# EAGLE schematic gate_controller_A3 (EAGLE 7.2.0)
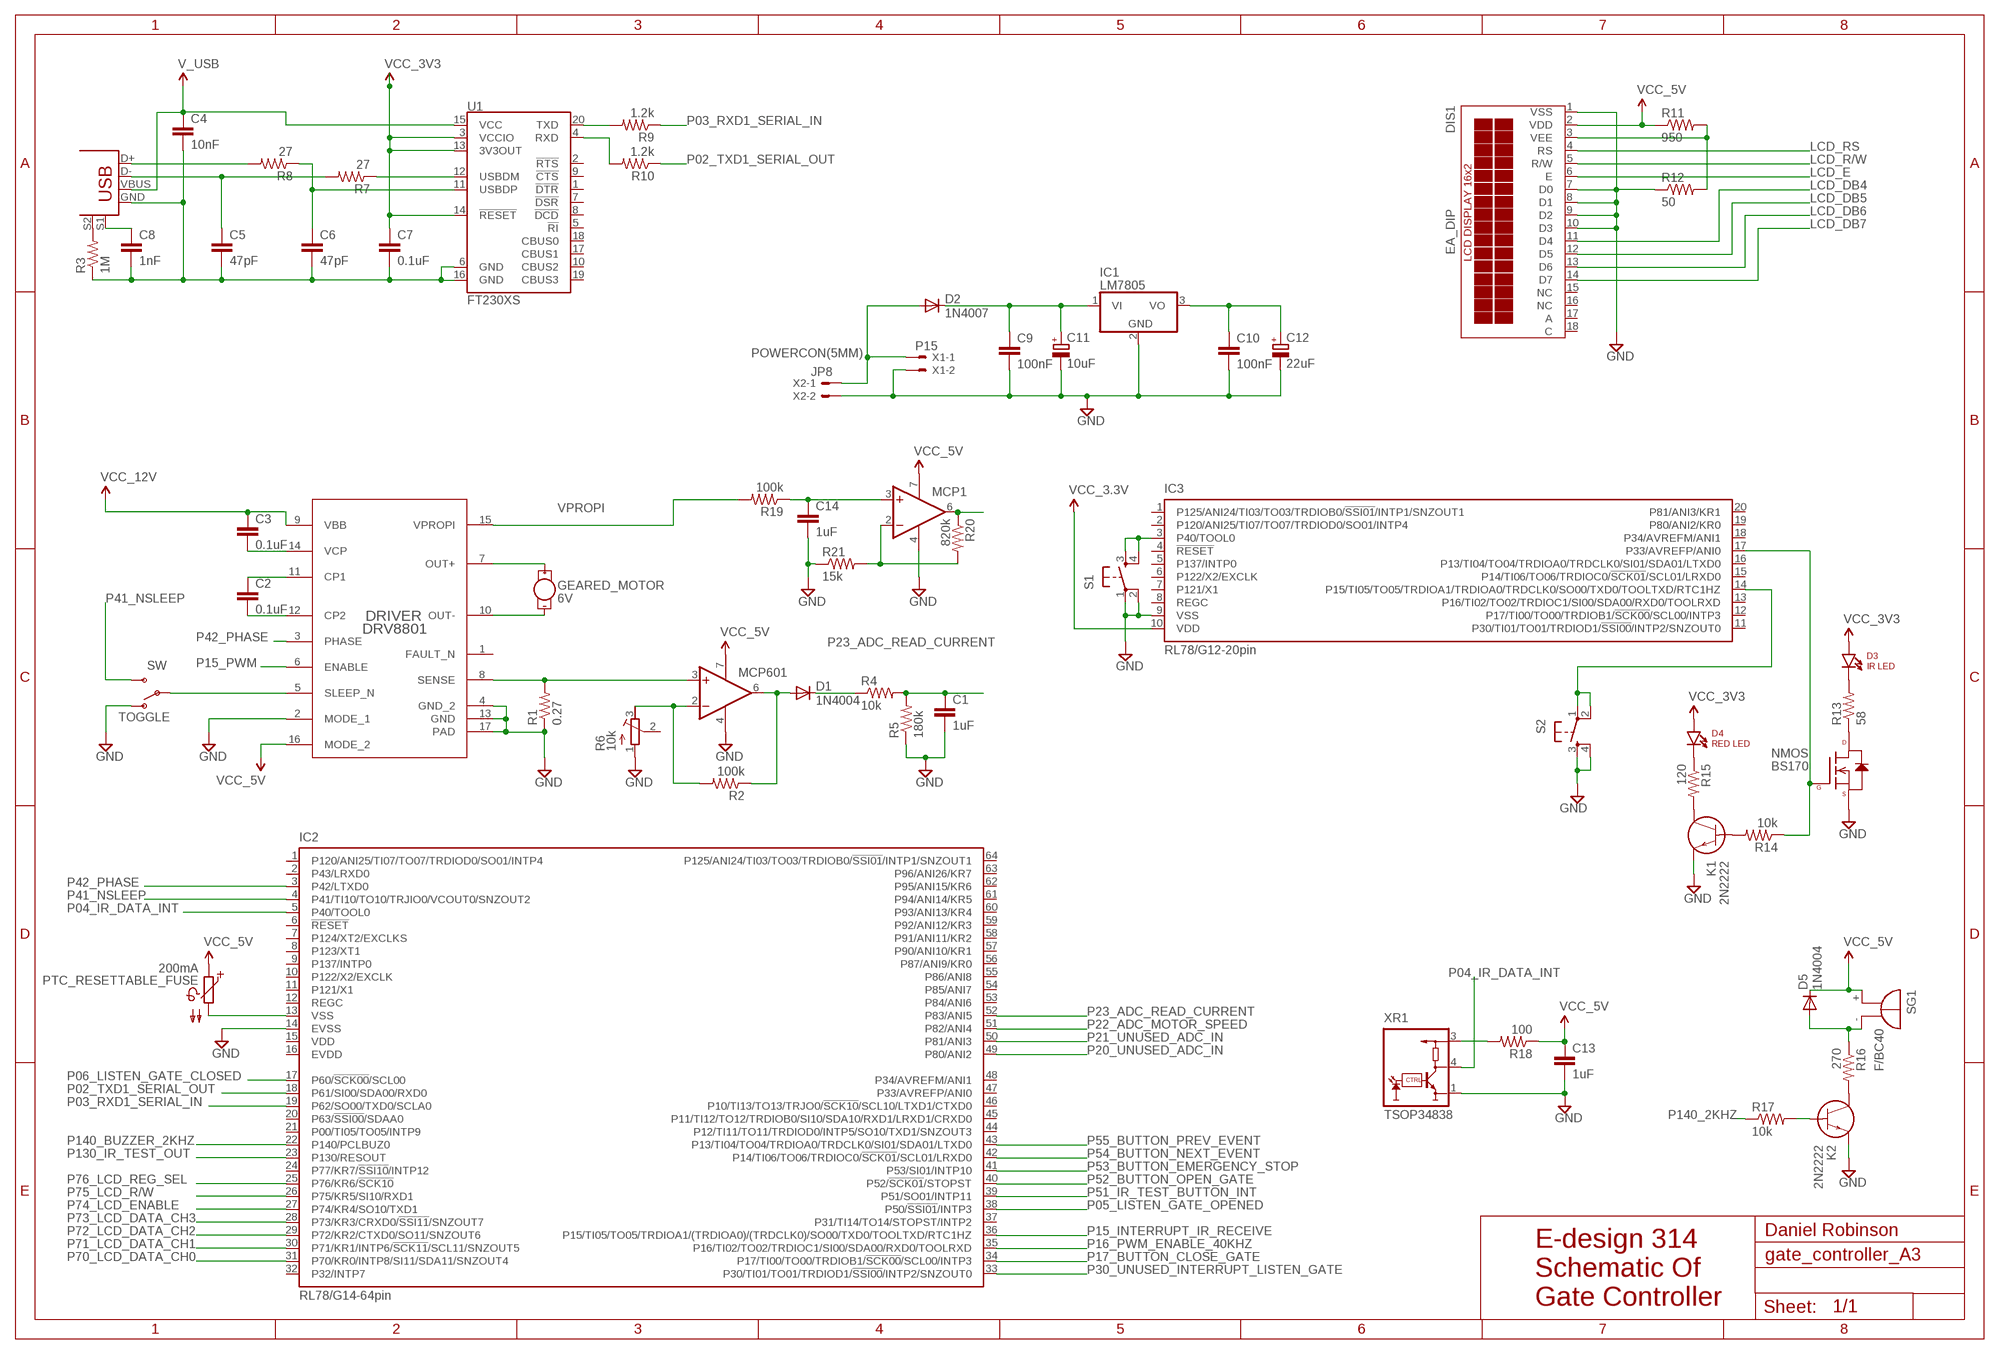
[diagram p0: schematic, sheet 1]

## Parts
C1  1uF  C2,5-3  [C2.5-3]
C2  0.1uF  C2,5-3  [C2.5-3]
C3  0.1uF  C2,5-3  [C2.5-3]
C4  10nF  C2,5-3  [C2.5-3]
C5  47pF  C2,5-3  [C2.5-3]
C6  47pF  C2,5-3  [C2.5-3]
C7  0.1uF  C2,5-3  [C2.5-3]
C8  1nF  C2,5-3  [C2.5-3]
C9  100nF  C2,5-3  [C2.5-3]
C10  100nF  C2,5-3  [C2.5-3]
C11  10uF  CPOL-EU085CS-1AR  [085CS_1AR]
C12  22uF  CPOL-EU085CS-1AR  [085CS_1AR]
C13  1uF  C2,5-3  [C2.5-3]
C14  1uF  C2,5-3  [C2.5-3]
D1  1N4004  [DO41-10]
D2  1N4007  1N4004  [DO41-10]
D3  IR LED  LTE-302  [LTE-302]
D4  RED LED  LTE-302  [LTE-302]
D5  1N4004  [DO41-10]
DIS1  EA_DIP  [EA_DIP]
DRIVER  DRV8801  DRV8801PWPR  [PWP0016B_N]
GEARED_MOTOR  6V  MOTOR10MM  [VIBE-MOTOR-10MM]
IC1  LM7805  LM2937  [TO263-3]
IC2  RL78/G14-64pin  RL78/F13-64  [P-LFQFP64-10X10]
IC3  RL78/G12-20pin  RL78/F13-20  [PP_SSOP20_7.62MM]
K1  2N2222  NPN-TRANSISTOR  [NPN-TRANSISTOR]
K2  2N2222  NPN-TRANSISTOR  [NPN-TRANSISTOR]
MCP1  1AMP_P7+4N  [DIL08]
MCP601  1AMP_P7+4N  [DIL08]
NMOS  BS170  N-CHANNEL-MOSFET-BSS138  [SOT23-3]
PTC_RESETTABLE_FUSE  200mA  PTC660  [P660]
R1  0.27  R-US_0204/2V  [0204V]
R2  100k  R-US_0204/2V  [0204V]
R3  1M  R-US_0204/2V  [0204V]
R4  10k  R-US_0204/2V  [0204V]
R5  180k  R-US_0204/2V  [0204V]
R6  10k  R-TRIMM64W  [RTRIM64W]
R7  27  R-US_0204/2V  [0204V]
R8  27  R-US_0204/2V  [0204V]
R9  1.2k  R-US_0204/2V  [0204V]
R10  1.2k  R-US_0204/2V  [0204V]
R11  950  R-US_0204/2V  [0204V]
R12  50  R-US_0204/2V  [0204V]
R13  58  R-US_0204/2V  [0204V]
R14  10k  R-US_0204/2V  [0204V]
R15  120  R-US_0204/2V  [0204V]
R16  270  R-US_0204/2V  [0204V]
R17  10k  R-US_0204/2V  [0204V]
R18  100  R-US_0204/2V  [0204V]
R19  100k  R-US_0204/2V  [0204V]
R20  820k  R-US_0204/2V  [0204V]
R21  15k  R-US_0204/2V  [0204V]
S1  TAC_SWITCHPTH  [TACTILE-PTH]
S2  TAC_SWITCHPTH  [TACTILE-PTH]
SG1  F/BC40  [F/BC40]
SW  TOGGLE  SWITCH_SPDT  [KPS-1290]
U1  FT230XS  FT231XS  [SSOP20_L]
U$1  USB+SHIELD  [USB-B-PTH]
X1  P15  22-23-2021  [22-23-2021]
X2  JP8  22-23-2021  [22-23-2021]
XR1  TSOP34838  TSSP6P38  [TSSP6P38]

## Nets
5V_INPUT: IC2.13(VSS) PTC_RESETTABLE_FUSE.2
GND: C1.2 C9.2 C10.2 C11.- C12.- C13.2 C14.2 DIS1.1(VSS) DIS1.7(D0) DIS1.8(D1) DIS1.9(D2) DIS1.10(D3) DRIVER.2(MODE_1) DRIVER.4(GND_2) DRIVER.13(GND) DRIVER.17(PAD) IC1.2(GND) IC2.14(EVSS) IC3.9(VSS) K1.E K2.E MCP1.4(V-) MCP601.4(V-) NMOS.2(S) R1.1 R5.1 R6.1(A) R12.1 R21.1 S1.1 S1.2 S2.3 S2.4 SW.O X1.2 X2.2 XR1.1(GND)
LCD_DB4: DIS1.11(D4)
LCD_DB5: DIS1.12(D5)
LCD_DB6: DIS1.13(D6)
LCD_DB7: DIS1.14(D7)
LCD_E: DIS1.6(E)
LCD_R/W: DIS1.5(R/W)
LCD_RS: DIS1.4(RS)
N$1: DRIVER.8(SENSE) MCP601.3(+IN) R1.2
N$2: MCP601.2(-IN) R2.2 R6.3(E)
N$3: D1.A MCP601.6(OUT) R2.1
N$4: D1.C R4.1
N$5: DRIVER.7(OUT+) GEARED_MOTOR.+
N$6: DRIVER.10(OUT-) GEARED_MOTOR.-
N$7: C2.2 DRIVER.12(CP2)
N$8: DRIVER.5(SLEEP_N) SW.P
N$9: C2.1 DRIVER.11(CP1)
N$10: C3.2 DRIVER.14(VCP)
N$11: R3.2 U$1.S2
N$12: R7.1 U1.12(USBDM)
N$13: C5.1 R7.2 U$1.D-
N$14: R8.2 U$1.D+
N$15: C6.1 R8.1 U1.11(USBDP)
N$16: C9.1 C11.+ D2.C IC1.1(VI)
N$17: R9.2 U1.20(TXD)
N$18: R10.2 U1.4(RXD)
N$19: C4.2 C5.2 C6.2 C7.2 C8.2 R3.1 U1.6(GND) U1.16(GND) U$1.GND
N$20: C8.1 U$1.S1
N$21: C10.1 C12.+ IC1.3(VO)
N$22: DIS1.3(VEE) R11.2 R12.2
N$23: K1.B R14.2
N$24: IC3.14(P15/TI05/TO05/TRDIOA1/TRDIOA0/TRDCLK0/SO00/TXD0/TOOLTXD/RTC1HZ) S2.1 S2.2
N$25: NMOS.3(D) R13.1
N$26: IC3.3(P40/TOOL0) S1.3 S1.4
N$27: D3.C R13.2
N$28: D5.A R16.1 SG1.-
N$29: K1.C R15.2
N$30: D4.C R15.1
N$31: IC3.17(P33/AVREFP/ANI0) NMOS.1(G) R14.1
N$32: K2.C R16.2
N$33: R18.2 XR1.3(VS)
N$34: K2.B R17.2
N$35: MCP1.6(OUT) R20.1
N$36: MCP1.2(-IN) R20.2 R21.2
N$37: C14.1 MCP1.3(+IN)
P02_TXD1_SERIAL_OUT: IC2.18(P61/SI00/SDA00/RXD0) R10.1
P03_RXD1_SERIAL_IN: IC2.19(P62/SO00/TXD0/SCLA0) R9.1
P04_IR_DATA_INT: IC2.5(P40/TOOL0) XR1.4(OUT)
P05_LISTEN_GATE_OPENED: IC2.38(P50/!SSI01!/INTP3)
P06_LISTEN_GATE_CLOSED: IC2.17(P60/!SCK00!/SCL00)
P15_INTERRUPT_IR_RECEIVE: IC2.36(P15/TI05/TO05/TRDIOA1/(TRDIOA0)/(TRDCLK0)/SO00/TXD0/TOOLTXD/RTC1HZ)
P15_PWM: DRIVER.6(ENABLE)
P16_PWM_ENABLE_40KHZ: IC2.35(P16/TI02/TO02/TRDIOC1/SI00/SDA00/RXD0/TOOLRXD)
P17_BUTTON_CLOSE_GATE: IC2.34(P17/TI00/TO00/TRDIOB1/!SCK00!/SCL00/INTP3)
P20_UNUSED_ADC_IN: IC2.49(P80/ANI2)
P21_UNUSED_ADC_IN: IC2.50(P81/ANI3)
P22_ADC_MOTOR_SPEED: IC2.51(P82/ANI4)
P23_ADC_READ_CURRENT: C1.1 IC2.52(P83/ANI5) R4.2 R5.2
P30_UNUSED_INTERRUPT_LISTEN_GATE: IC2.33(P30/TI01/TO01/TRDIOD1/!SSI00!/INTP2/SNZOUT0)
P41_NSLEEP: IC2.4(P41/TI10/TO10/TRJIO0/VCOUT0/SNZOUT2) SW.S
P42_PHASE: DRIVER.3(PHASE) IC2.3(P42/LTXD0)
P51_IR_TEST_BUTTON_INT: IC2.39(P51/SO01/INTP11)
P52_BUTTON_OPEN_GATE: IC2.40(P52/!SCK01!/STOPST)
P53_BUTTON_EMERGENCY_STOP: IC2.41(P53/SI01/INTP10)
P54_BUTTON_NEXT_EVENT: IC2.42(P14/TI06/TO06/TRDIOC0/!SCK01!/SCL01/LRXD0)
P55_BUTTON_PREV_EVENT: IC2.43(P13/TI04/TO04/TRDIOA0/TRDCLK0/SI01/SDA01/LTXD0)
P70_LCD_DATA_CH0: IC2.31(P70/KR0/INTP8/SI11/SDA11/SNZOUT4)
P71_LCD_DATA_CH1: IC2.30(P71/KR1/INTP6/!SCK11!/SCL11/SNZOUT5)
P72_LCD_DATA_CH2: IC2.29(P72/KR2/CTXD0/SO11/SNZOUT6)
P73_LCD_DATA_CH3: IC2.28(P73/KR3/CRXD0/!SSI11!/SNZOUT7)
P74_LCD_ENABLE: IC2.27(P74/KR4/SO10/TXD1)
P75_LCD_R/W: IC2.26(P75/KR5/SI10/RXD1)
P76_LCD_REG_SEL: IC2.25(P76/KR6/!SCK10)
P130_IR_TEST_OUT: IC2.23(P130/RESOUT)
P140_2KHZ: R17.1
P140_BUZZER_2KHZ: IC2.22(P140/PCLBUZ0)
POWERCON(5MM): D2.A X1.1 X2.1
VCC: C3.1 C4.1 C7.1 C13.1 D3.A D4.A D5.C DIS1.2(VDD) DRIVER.9(VBB) DRIVER.16(MODE_2) IC3.10(VDD) MCP1.7(V+) MCP601.7(V+) PTC_RESETTABLE_FUSE.1 R11.1 R18.1 SG1.+ U1.3(VCCIO) U1.13(3V3OUT) U1.14(!RESET) U1.15(VCC) U$1.VBUS ; supply symbol labelled VCC_12V, VCC_5V, VCC_3V3, V_USB, VCC_3.3V
VPROPI: DRIVER.15(VPROPI) R19.2
Unconnected: DIS1.15(NC) DIS1.16(NC) DIS1.17(A) DIS1.18(C) DRIVER.1(FAULT_N) IC2.1(P120/ANI25/TI07/TO07/TRDIOD0/SO01/INTP4) IC2.2(P43/LRXD0) IC2.6(!RESET) IC2.7(P124/XT2/EXCLKS) IC2.8(P123/XT1) IC2.9(P137/INTP0) IC2.10(P122/X2/EXCLK) IC2.11(P121/X1) IC2.12(REGC) IC2.20(P63/!SSI00!/SDAA0) IC2.21(P00/TI05/TO05/INTP9) IC2.24(P77/KR7/!SSI10!/INTP12) IC2.32(P32/INTP7) IC2.37(P31/TI14/TO14/STOPST/INTP2) IC2.44(P12/TI11/TO11/TRDIOD0/INTP5/SO10/TXD1/SNZOUT3) IC2.45(P11/TI12/TO12/TRDIOB0/SI10/SDA10/RXD1/LRXD1/CRXD0) IC2.46(P10/TI13/TO13/TRJO0/!SCK10!/SCL10/LTXD1/CTXD0) IC2.47(P33/AVREFP/ANI0) IC2.48(P34/AVREFM/ANI1) IC2.53(P84/ANI6) IC2.54(P85/ANI7) IC2.55(P86/ANI8) IC2.56(P87/ANI9/KR0) IC2.57(P90/ANI10/KR1) IC2.58(P91/ANI11/KR2) IC2.59(P92/ANI12/KR3) IC2.60(P93/ANI13/KR4) IC2.61(P94/ANI14/KR5) IC2.62(P95/ANI15/KR6) IC2.63(P96/ANI26/KR7) IC2.64(P125/ANI24/TI03/TO03/TRDIOB0/!SSI01!/INTP1/SNZOUT1) IC3.1(P125/ANI24/TI03/TO03/TRDIOB0/!SSI01!/INTP1/SNZOUT1) IC3.2(P120/ANI25/TI07/TO07/TRDIOD0/SO01/INTP4) IC3.4(!RESET) IC3.5(P137/INTP0) IC3.6(P122/X2/EXCLK) IC3.7(P121/X1) IC3.8(REGC) IC3.11(P30/TI01/TO01/TRDIOD1/!SSI00!/INTP2/SNZOUT0) IC3.12(P17/TI00/TO00/TRDIOB1/!SCK00!/SCL00/INTP3) IC3.13(P16/TI02/TO02/TRDIOC1/SI00/SDA00/RXD0/TOOLRXD) IC3.15(P14/TI06/TO06/TRDIOC0/!SCK01!/SCL01/LRXD0) IC3.16(P13/TI04/TO04/TRDIOA0/TRDCLK0/SI01/SDA01/LTXD0) IC3.18(P34/AVREFM/ANI1) IC3.19(P80/ANI2/KR0) IC3.20(P81/ANI3/KR1) R6.2(S) R19.1 U1.1(!DTR) U1.2(!RTS) U1.5(!RI) U1.7(!DSR) U1.8(!DCD) U1.9(!CTS) U1.10(CBUS2) U1.17(CBUS1) U1.18(CBUS0) U1.19(CBUS3)

## Notes on the sheet
- Daniel Robinson
- E-design 314 
  Schematic Of 
  Gate Controller

## Power pins joined to a net without a drawn wire
EVDD: IC2.16(EVDD)
VDD: IC2.15(VDD)

## Library data of the parts
C1-C10 C13 C14 = capacitor-wima:C: CAPACITOR naming: grid - package width
C11 C12 = rcl:CPOL-EU: POLARIZED CAPACITOR, European symbol
D1 D2 D5 = diode:1N4004: DIODE general purpose rectifier, 1 A
D3 D4 = SparkFun-LED:LTE-302: Through-hole side-firing 940nm IR LED
DIS1 = display-lcd:EA_DIP: LCD-MODUL 2x16 - 6,68mm, INKL. KONTROLLER HD44780 Source: Data sheet <http://www.lcd-module.de/pdf/doma/dip162-d.pdf>
DRIVER = DRV8801:DRV8801PWPR; COMPTYPE: IC; MANUFACTURER: Texas Instruments; MOUNTTYPE: SMT; PACKAGEREFERENCE: PWP0016B; PARTNUMBER: DRV8801PWP; PIN_COUNT: 17; REFDES: RefDes; ROHS: Y; TYPE: TYPE; VALUE: Value
GEARED_MOTOR = SparkFun-Electromechanical:MOTOR: Vibration Motor- ROB-08449 Physical dimension and wire connections for this powerful vibration motor. Motor has a self adhesive backing.
IC1 = linear:LM2937: LM2937-2.5, LM2937-3.3 400mA and 500mA Voltage Regulators Source: http://cache.national.com/ds/LM/LM2937-2.5.pdf
IC2 = micro-renesas:RL78/F13-64: 16-Bit Single-Chip Microcontroller Source: Data sheet <http://documentation.renesas.com/doc/products/mpumcu/doc/rl78/r01uh0368ej0200_rl78f13_14.pdf>
IC3 = micro-renesas:RL78/F13-20: 16-Bit Single-Chip Microcontroller Source: Data sheet <http://documentation.renesas.com/doc/products/mpumcu/doc/rl78/r01uh0368ej0200_rl78f13_14.pdf>
K1 K2 = e-halbleiter:NPN-TRANSISTOR: NPN-Transistor
MCP1 MCP601 = linear:1AMP_P7+4: OP AMP
NMOS = GeekAmmo:N-CHANNEL-MOSFET: N-Channel MOSFET Mode Field Effect Transistor; DATASHEET: http://www.fairchildsemi.com/ds/BS/BSS138.pdf; DIGIKEY: BSS138TR-ND; ELEMENT14: 2323154; URL: http://au.element14.com/fairchild-semiconductor/bss138/mosfet-n-ch-50v-220ma-sot-23/dp/2323154
PTC_RESETTABLE_FUSE = ptc-ntc:PTC660: PHILIPS PTC; OC_FARNELL: unknown; OC_NEWARK: unknown
R1-R5 R7-R10 R13-R21 = resistor:R-US_: RESISTOR, American symbol
R6 = rcl:R-TRIMM: Trimm resistor
R11 R12 = rcl:R-US_: RESISTOR, American symbol
S1 S2 = SparkFun-Retired:TAC_SWITCH: Momentary Switch Button commonly used for reset or general input. Spark Fun Electronics SKU : COM-00097 SMT- SWCH-08247
SG1 = buzzer:F/BC40: BUZZER Source: Spoerle; OC_FARNELL: unknown; OC_NEWARK: unknown
SW = SparkFun-Electromechanical:SWITCH_SPDT: SWCH-10651 Side-actuated SPDT slide switch, as used on the Arduino Pro; PROD_ID: SWCH-10651
U1 = SparkFun-DigitalIC:FT231X: FTDI FT231X Full Speed USB to Full-handshake UART This USB2.0 Full Speed IC offers a compact bridge to full handshake UART interfaces. The device is a UART, capable of operating up to 3MBaud, with low power consumption (8mA). The FT231X includes the complete FT-X series feature set and enables USB to be added into a system design quickly and easily over a UART interface.; PROD_ID: IC-11524; VALUE: FT231XS
U$1 = SparkFun-Connectors:USB+SHIELD: USB+Shield USB connector with shield pins connectable
X1 X2 = con-molex:22-23-2021: .100" (2.54mm) Center Header - 2 Pin; MF: MOLEX; MPN: 22-23-2021; OC_FARNELL: 1462926; OC_NEWARK: 25C3832
XR1 = opto-vishay:TSSP6P38: IR Mid Range Proximity Sensor Used source: IR Sensor transmitter and receiver diode.pdf Source to corrupt Data sheet <http://www.vishay.com/docs/82475/tssp6p38.pdf>